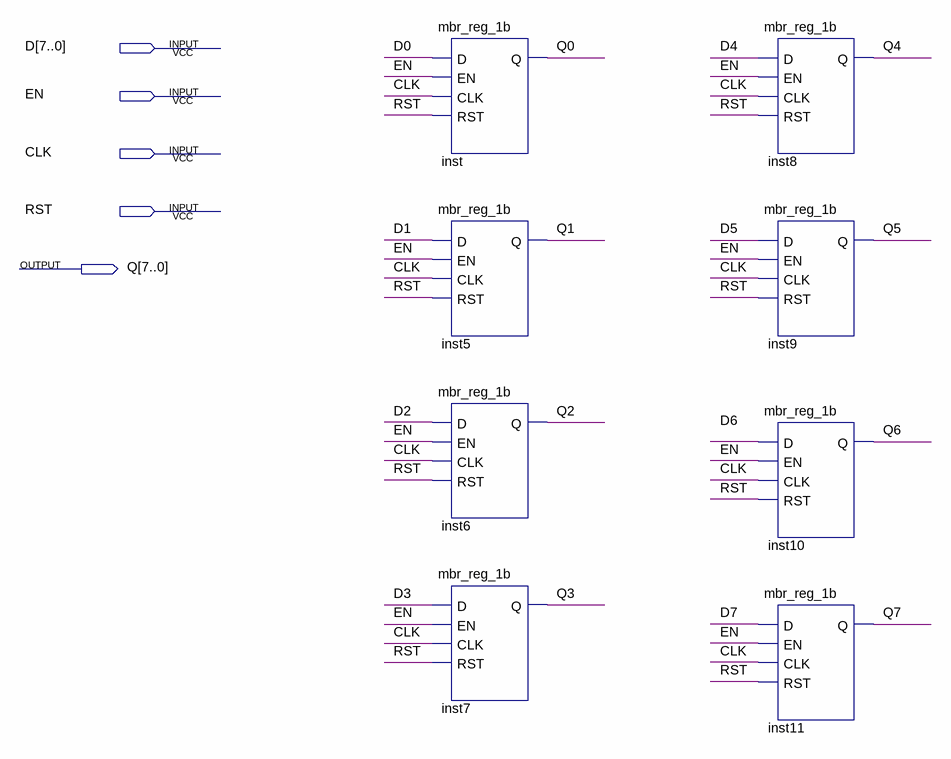
[diagram p0: schematic sheet]
// Quartus schematic mbr_reg_8b.bdf as structural Verilog: 8 symbols, 5 pins
module mbr_reg_8b (
  input  [7:0] D,
  input  EN,
  input  CLK,
  input  RST,
  output [7:0] Q
);

  mbr_reg_1b inst (.D(D[0]), .EN(EN), .CLK(CLK), .RST(RST), .Q(Q[0]));
  mbr_reg_1b inst5 (.D(D[1]), .EN(EN), .CLK(CLK), .RST(RST), .Q(Q[1]));
  mbr_reg_1b inst6 (.D(D[2]), .EN(EN), .CLK(CLK), .RST(RST), .Q(Q[2]));
  mbr_reg_1b inst7 (.D(D[3]), .EN(EN), .CLK(CLK), .RST(RST), .Q(Q[3]));
  mbr_reg_1b inst8 (.D(D[4]), .EN(EN), .CLK(CLK), .RST(RST), .Q(Q[4]));
  mbr_reg_1b inst9 (.D(D[5]), .EN(EN), .CLK(CLK), .RST(RST), .Q(Q[5]));
  mbr_reg_1b inst10 (.D(D[6]), .EN(EN), .CLK(CLK), .RST(RST), .Q(Q[6]));
  mbr_reg_1b inst11 (.D(D[7]), .EN(EN), .CLK(CLK), .RST(RST), .Q(Q[7]));
endmodule
